# Altium schematic sheet 双电机驱动.SchDoc
size A2
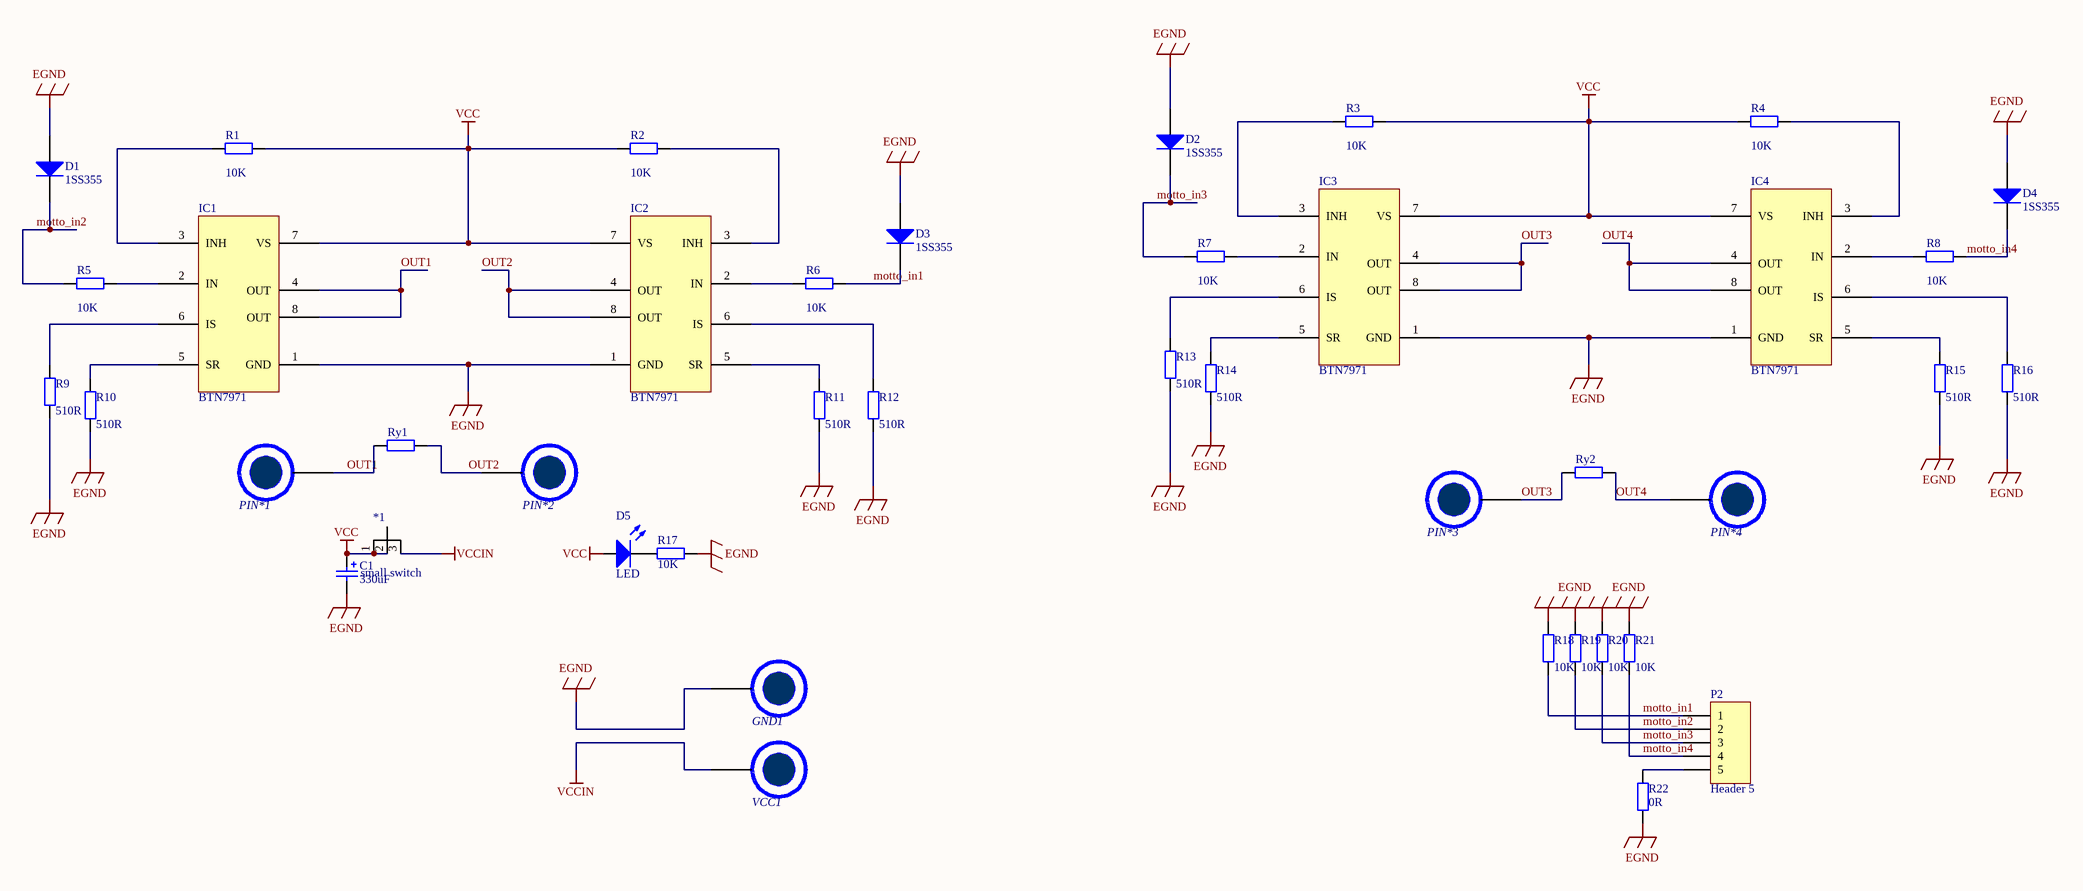
[diagram p0: 双电机驱动.SchDoc]

## Parts
*1  small switch  [small switch]
C1  330uF  [SMD-EC-F12.5]
D1  1SS355  [hole-chip diode]
D2  1SS355  [hole-chip diode]
D3  1SS355  [hole-chip diode]
D4  1SS355  [hole-chip diode]
D5  LED  [1206(2)]
GND1  PIN  [PIN]  (value not drawn)
IC1  BTN7971  [PG-TO263-7-1]
IC2  BTN7971  [PG-TO263-7-1]
IC3  BTN7971  [PG-TO263-7-1]
IC4  BTN7971  [PG-TO263-7-1]
P2  Header 5  [HDR1X5]
PIN*1  PIN  [PIN]  (value not drawn)
PIN*2  PIN  [PIN]  (value not drawn)
PIN*3  PIN  [PIN]  (value not drawn)
PIN*4  PIN  [PIN]  (value not drawn)
R1  value 10K  [1206(2)]  (hidden comment: Res2)
R2  value 10K  [1206(2)]  (hidden comment: Res2)
R3  value 10K  [1206(2)]  (hidden comment: Res2)
R4  value 10K  [1206(2)]  (hidden comment: Res2)
R5  value 10K  [1206(2)]  (hidden comment: Res2)
R6  value 10K  [1206(2)]  (hidden comment: Res2)
R7  value 10K  [1206(2)]  (hidden comment: Res2)
R8  value 10K  [1206(2)]  (hidden comment: Res2)
R9  value 510R  [1206(2)]  (hidden comment: Res2)
R10  value 510R  [1206(2)]  (hidden comment: Res2)
R11  value 510R  [1206(2)]  (hidden comment: Res2)
R12  value 510R  [1206(2)]  (hidden comment: Res2)
R13  value 510R  [1206(2)]  (hidden comment: Res2)
R14  value 510R  [1206(2)]  (hidden comment: Res2)
R15  value 510R  [1206(2)]  (hidden comment: Res2)
R16  value 510R  [1206(2)]  (hidden comment: Res2)
R17  10K  [1206(2)]
R18  value 10K  [R2012]  (hidden comment: Res2)
R19  value 10K  [R2012]  (hidden comment: Res2)
R20  value 10K  [R2012]  (hidden comment: Res2)
R21  value 10K  [R2012]  (hidden comment: Res2)
R22  value 0R  [R2012]  (hidden comment: Res2)
Ry1  (no value)  [1206(2)]
Ry2  (no value)  [1206(2)]
VCC1  PIN  [PIN]  (value not drawn)

## Nets
EGND: C1.2 D1.1(A) D2.1(A) D3.1(A) D4.1(A) GND1.1(PIN) IC1.1(GND) IC2.1(GND) IC3.1(GND) IC4.1(GND) R9.1 R10.1 R11.1 R12.1 R13.1 R14.1 R15.1 R16.1 R17.1 R18.2 R19.2 R20.2 R21.2 R22.2
VCC: *1.1 *1.2 C1.1 D5.1 IC1.7(VS) IC2.7(VS) IC3.7(VS) IC4.7(VS) R1.2 R2.1 R3.2 R4.1
VCCIN: *1.3 VCC1.1(PIN)
motto_in1: D3.2(K) P2.1 R6.2 R18.1
motto_in2: D1.2(K) P2.2 R5.1 R19.1
motto_in3: D2.2(K) P2.3 R7.1 R20.1
motto_in4: D4.2(K) P2.4 R8.2 R21.1
OUT1: IC1.4(OUT) IC1.8(OUT) PIN*1.1(PIN) Ry1.1
OUT2: IC2.4(OUT) IC2.8(OUT) PIN*2.1(PIN) Ry1.2
OUT3: IC3.4(OUT) IC3.8(OUT) PIN*3.1(PIN) Ry2.1
OUT4: IC4.4(OUT) IC4.8(OUT) PIN*4.1(PIN) Ry2.2
NetD5_2: D5.2 R17.2
NetIC1_2: IC1.2(IN) R5.2
NetIC1_3: IC1.3(INH) R1.1
NetIC1_5: IC1.5(SR) R10.2
NetIC1_6: IC1.6(IS) R9.2
NetIC2_2: IC2.2(IN) R6.1
NetIC2_3: IC2.3(INH) R2.2
NetIC2_5: IC2.5(SR) R11.2
NetIC2_6: IC2.6(IS) R12.2
NetIC3_2: IC3.2(IN) R7.2
NetIC3_3: IC3.3(INH) R3.1
NetIC3_5: IC3.5(SR) R14.2
NetIC3_6: IC3.6(IS) R13.2
NetIC4_2: IC4.2(IN) R8.1
NetIC4_3: IC4.3(INH) R4.2
NetIC4_5: IC4.5(SR) R15.2
NetIC4_6: IC4.6(IS) R16.2
NetP2_5: P2.5 R22.1

## Library data of the parts
C1 = Cap Pol1: Polarized Capacitor (Radial)
D1-D4 = Diode 1N4148: High Conductance Fast Diode; LatestRevisionDate: 17-Jul-2002; LatestRevisionNote: Re-released for DXP Platform.; DatasheetDocument: 1997; PackageReference: DO-35; Publisher: Altium Limited; Code_JEDEC: DO-204-AH; ComponentLink1Description: Manufacturer Link; ComponentLink2Description: Datasheet; ComponentLink2URL: http://www.fairchildsemi.com/ds/1N%2F1N4148.pdf
D5 = LED: Typical INFRARED GaAs LED
IC1-IC4 = BTN7960
P2 = Header 5: Header, 5-Pin; LatestRevisionDate: 17-Jul-2002; LatestRevisionNote: Re-released for DXP Platform.; Publisher: Altium Limited
R1-R16 R18-R22 = Res2: Resistor; Published: 8-Jun-2000; LatestRevisionDate: 17-Jul-2002; LatestRevisionNote: Re-released for DXP Platform.; PackageReference: AXIAL-0.4; Publisher: Altium Limited; PackageDescription: Axial Device, Thru-Hole; 2 Leads; 0.4 in Pin Spacing
R17 Ry1 Ry2 = Res: Resistor